# Altium schematic sheet Sheet8.SchDoc: solar-powered-remote-water-level-relay
size 419 x 297 mm; Date: 2026/06/29; Author: forlook88@gmail.com; Revision: 0; SheetNumber: 8; SheetTotal: 11
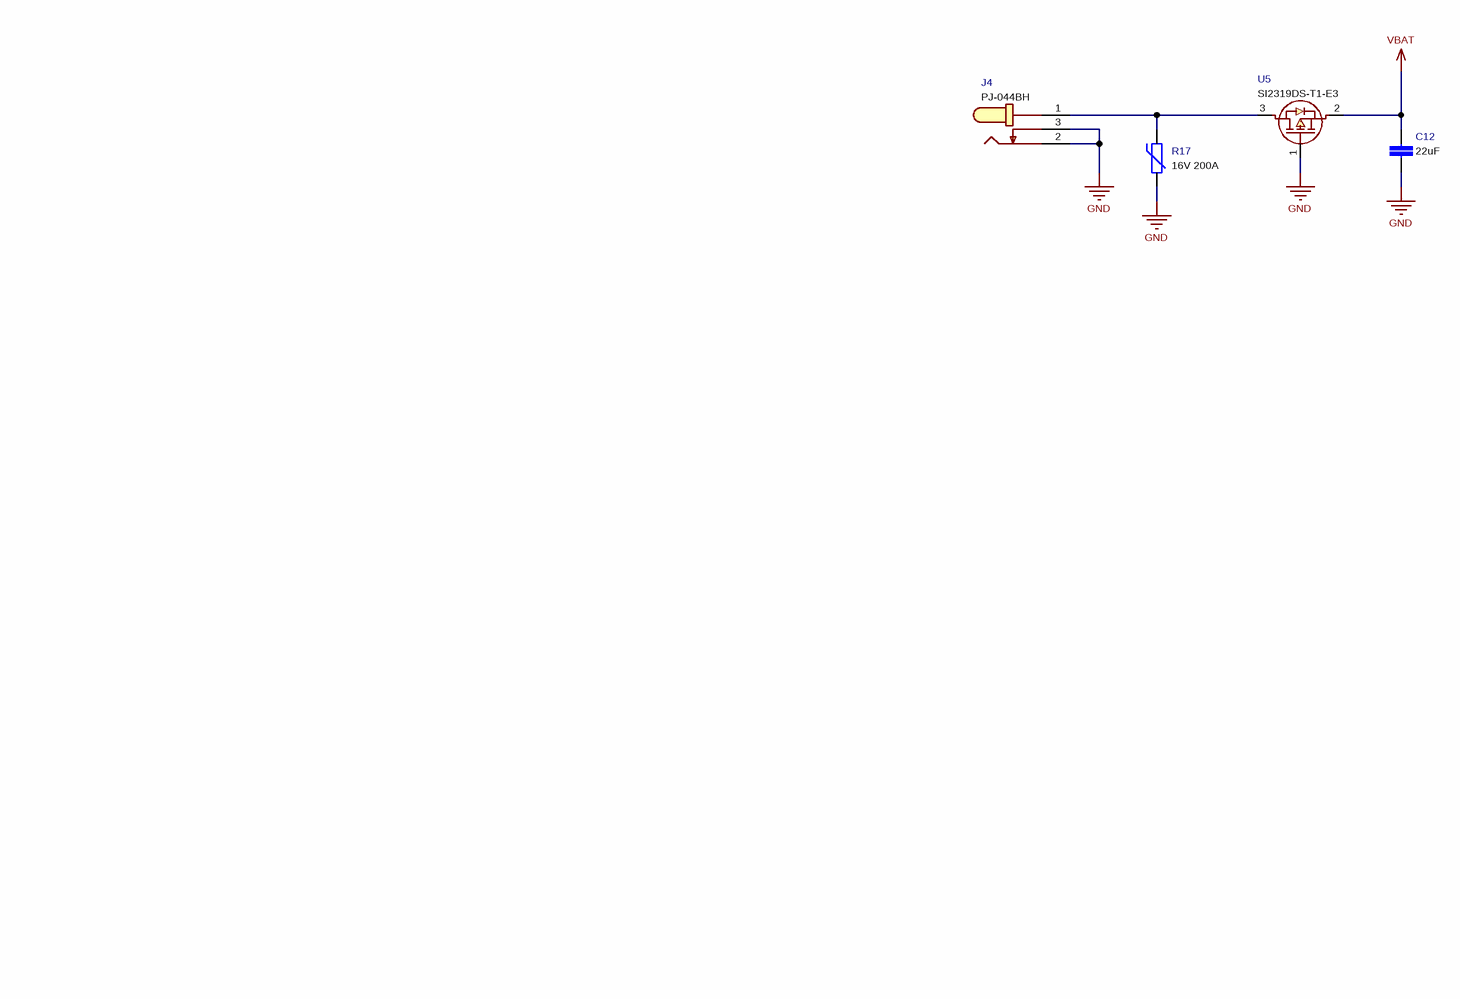
[diagram p0: Sheet8.SchDoc]

## Parts
C12  value 22uF
J4  value PJ-044BH
R17  value 16V 200A
U5  value SI2319DS-T1-E3

## Nets
GND: C12.2 J4.2 J4.3 R17.1 U5.1(G)
VBAT: C12.1 U5.2(S)
NetJ4_1: J4.1 R17.2 U5.3(D)

## Notes on the sheet
- Document Name:
- Project Name:
- Sheet Name:
- Sheet Number:
- Author:
- CELUS Design Platform electronic designs are machine-generated drafts and require verification by qualified specialists.
- of
- Revision:
- Date:
- By using these designs, you agree to the CELUS Terms of Use: https://www.celus.io/terms-of-use

## Library data of the parts
C12 = (no symbol name): Manufacturer Part Number: GRT21BR61E226ME13L; Manufacturer: Murata
J4 = (no symbol name): Manufacturer: CUI Devices; Manufacturer Part Number: PJ-044BH
R17 = (no symbol name): Manufacturer Part Number: 0805SA240-1R5J; Manufacturer: SFI Electronics
U5 = (no symbol name): Manufacturer: Vishay; Manufacturer Part Number: SI2319DS-T1-E3